# Altium schematic sheet iPhone11ProMaxNEI.SchDoc
size A
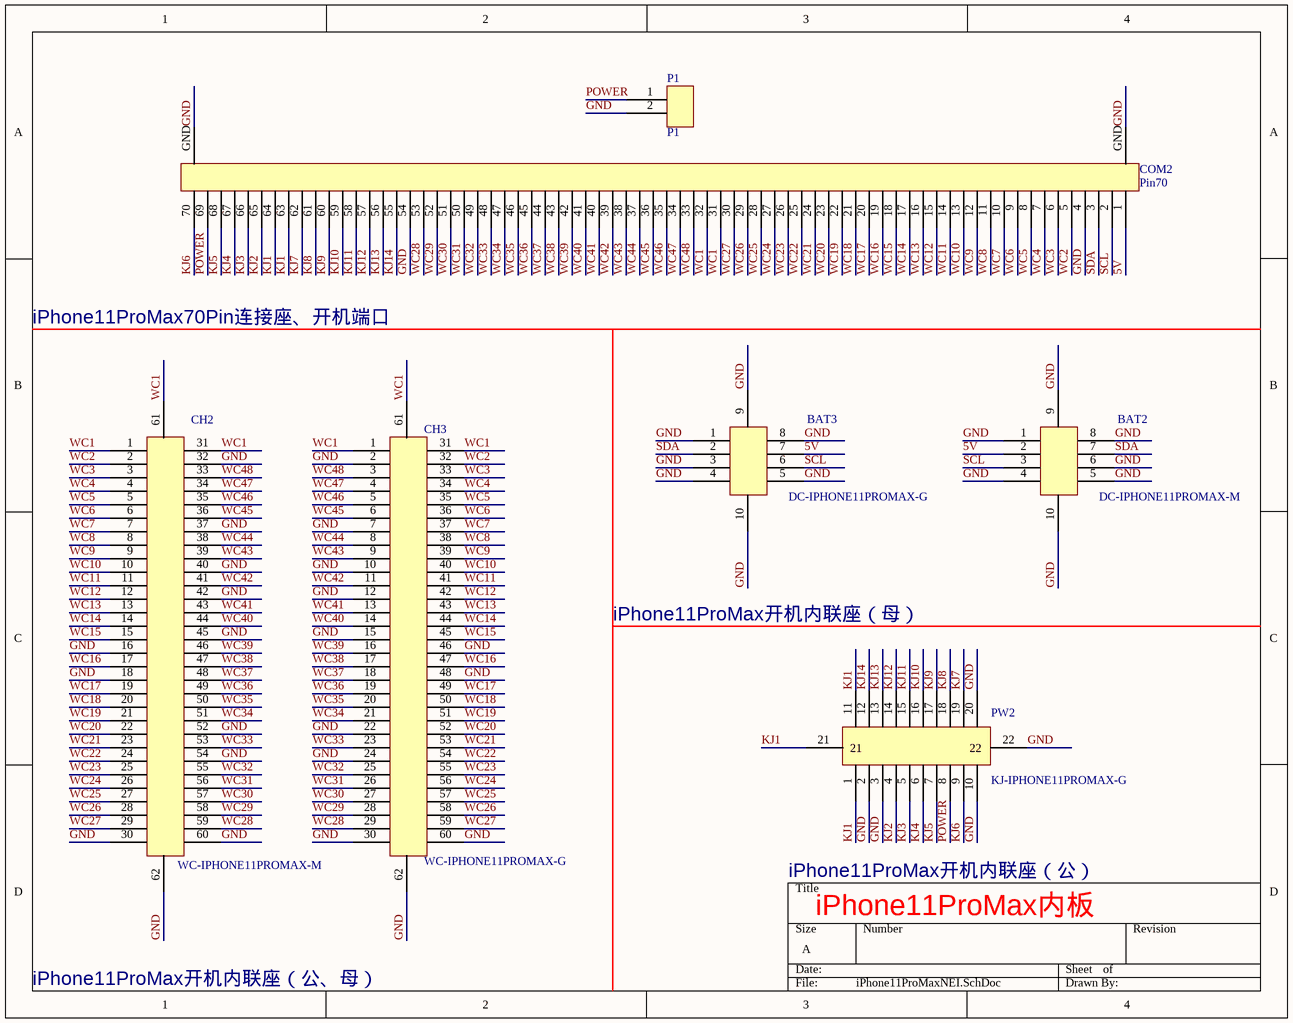
[diagram p0: iPhone11ProMaxNEI.SchDoc]

## Parts
BAT2  DC-IPHONE11PROMAX-M  [IPHONE11-WXCD-M]
BAT3  DC-IPHONE11PROMAX-G  [IPHONE11-WXCD-G]
CH2  WC-IPHONE11PROMAX-M  [IPHONE11PROMAX-WC-M]
CH3  WC-IPHONE11PROMAX-G  [IPHONE11PROMAX-WC-G]
COM2  Pin70  [Pin70]
P1  P1  [P-2]
PW2  KJ-IPHONE11PROMAX-G  [IPHONE11PROMAX-KJ-G]

## Nets
5V: BAT2.2 BAT3.7 COM2.1
GND: BAT2.1 BAT2.4 BAT2.5 BAT2.6 BAT2.8 BAT2.9 BAT2.10 BAT3.1 BAT3.3 BAT3.4 BAT3.5 BAT3.8 BAT3.9 BAT3.10 CH2.16 CH2.18 CH2.30 CH2.32 CH2.37 CH2.40 CH2.42 CH2.45 CH2.52 CH2.54 CH2.60 CH2.62 CH3.2 CH3.7 CH3.10 CH3.12 CH3.15 CH3.22 CH3.24 CH3.30 CH3.46 CH3.48 CH3.60 CH3.62 COM2.4 COM2.54 COM2.GND P1.2 PW2.2 PW2.3 PW2.10 PW2.20 PW2.22
KJ1: COM2.63 COM2.64 PW2.1 PW2.11 PW2.21
KJ2: COM2.65 PW2.4
KJ3: COM2.66 PW2.5
KJ4: COM2.67 PW2.6
KJ5: COM2.68 PW2.7
KJ6: COM2.70 PW2.9
KJ7: COM2.62 PW2.19
KJ8: COM2.61 PW2.18
KJ9: COM2.60 PW2.17
KJ10: COM2.59 PW2.16
KJ11: COM2.58 PW2.15
KJ12: COM2.57 PW2.14
KJ13: COM2.56 PW2.13
KJ14: COM2.55 PW2.12
POWER: COM2.69 P1.1 PW2.8
SCL: BAT2.3 BAT3.6 COM2.2
SDA: BAT2.7 BAT3.2 COM2.3
WC1: CH2.1 CH2.31 CH2.61 CH3.1 CH3.31 CH3.61 COM2.31 COM2.32
WC2: CH2.2 CH3.32 COM2.5
WC3: CH2.3 CH3.33 COM2.6
WC4: CH2.4 CH3.34 COM2.7
WC5: CH2.5 CH3.35 COM2.8
WC6: CH2.6 CH3.36 COM2.9
WC7: CH2.7 CH3.37 COM2.10
WC8: CH2.8 CH3.38 COM2.11
WC9: CH2.9 CH3.39 COM2.12
WC10: CH2.10 CH3.40 COM2.13
WC11: CH2.11 CH3.41 COM2.14
WC12: CH2.12 CH3.42 COM2.15
WC13: CH2.13 CH3.43 COM2.16
WC14: CH2.14 CH3.44 COM2.17
WC15: CH2.15 CH3.45 COM2.18
WC16: CH2.17 CH3.47 COM2.19
WC17: CH2.19 CH3.49 COM2.20
WC18: CH2.20 CH3.50 COM2.21
WC19: CH2.21 CH3.51 COM2.22
WC20: CH2.22 CH3.52 COM2.23
WC21: CH2.23 CH3.53 COM2.24
WC22: CH2.24 CH3.54 COM2.25
WC23: CH2.25 CH3.55 COM2.26
WC24: CH2.26 CH3.56 COM2.27
WC25: CH2.27 CH3.57 COM2.28
WC26: CH2.28 CH3.58 COM2.29
WC27: CH2.29 CH3.59 COM2.30
WC28: CH2.59 CH3.29 COM2.53
WC29: CH2.58 CH3.28 COM2.52
WC30: CH2.57 CH3.27 COM2.51
WC31: CH2.56 CH3.26 COM2.50
WC32: CH2.55 CH3.25 COM2.49
WC33: CH2.53 CH3.23 COM2.48
WC34: CH2.51 CH3.21 COM2.47
WC35: CH2.50 CH3.20 COM2.46
WC36: CH2.49 CH3.19 COM2.45
WC37: CH2.48 CH3.18 COM2.44
WC38: CH2.47 CH3.17 COM2.43
WC39: CH2.46 CH3.16 COM2.42
WC40: CH2.44 CH3.14 COM2.41
WC41: CH2.43 CH3.13 COM2.40
WC42: CH2.41 CH3.11 COM2.39
WC43: CH2.39 CH3.9 COM2.38
WC44: CH2.38 CH3.8 COM2.37
WC45: CH2.36 CH3.6 COM2.36
WC46: CH2.35 CH3.5 COM2.35
WC47: CH2.34 CH3.4 COM2.34
WC48: CH2.33 CH3.3 COM2.33

## Notes on the sheet
- iPhone11ProMax70Pin连接座、开机端口
- iPhone11ProMax开机内联座（母）
- iPhone11ProMax开机内联座（公）
- iPhone11ProMax内板
- iPhone11ProMax开机内联座（公、母）

## Library data of the parts
BAT2 BAT3 = WXCD-IPHONE11-M